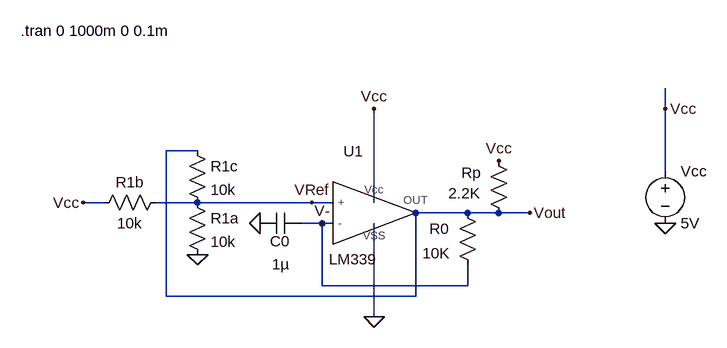
[diagram p0: schematic BAI 5 THUC HANH 2.asc]
BAI 5 THUC HANH 2.asc, the LTspice schematic file:
Version 4.1
SHEET 1 880 680
WIRE 640 -16 640 -48
WIRE -80 48 -128 48
WIRE 640 80 640 -16
WIRE -224 128 -256 128
WIRE -80 128 -144 128
WIRE 96 128 -80 128
WIRE 128 128 96 128
WIRE 192 128 192 -16
WIRE 336 144 256 144
WIRE 384 144 336 144
WIRE 432 144 384 144
WIRE 112 160 80 160
WIRE 128 160 112 160
WIRE 112 256 112 160
WIRE 336 256 336 224
WIRE 336 256 112 256
WIRE -128 272 -128 48
WIRE 256 272 256 144
WIRE 256 272 -128 272
WIRE 192 304 192 160
FLAG 640 160 0
FLAG 192 304 0
FLAG -80 208 0
FLAG 16 160 0
FLAG 432 144 Vout
FLAG 112 160 V-
FLAG 96 128 VRef
FLAG 640 -16 Vcc
FLAG 192 -16 Vcc
FLAG 384 64 Vcc
FLAG -256 128 Vcc
SYMBOL LM339 160 144 R0
SYMATTR InstName U1
SYMBOL voltage 640 64 R0
SYMATTR InstName Vcc
SYMATTR Value 5V
SYMBOL res -128 112 R90
WINDOW 0 0 56 VBottom 2
WINDOW 3 32 56 VTop 2
SYMATTR InstName R1b
SYMATTR Value 10k
SYMBOL res -96 112 R0
SYMATTR InstName R1a
SYMATTR Value 10k
SYMBOL res -96 32 R0
SYMATTR InstName R1c
SYMATTR Value 10k
SYMBOL cap 80 144 R90
WINDOW 0 59 33 VBottom 2
WINDOW 3 63 32 VTop 2
SYMATTR InstName C0
SYMATTR Value 1µ
SYMBOL res 320 128 R0
WINDOW 0 -43 40 Left 2
WINDOW 3 -54 78 Left 2
SYMATTR InstName R0
SYMATTR Value 10K
SYMBOL res 368 48 R0
WINDOW 0 -42 34 Left 2
WINDOW 3 -62 66 Left 2
SYMATTR InstName Rp
SYMATTR Value 2.2K
TEXT -352 -136 Left 2 !.tran 0 1000m 0 0.1m

The netlist it stands for:
* BAI 5 THUC HANH 2.asc
X§U1 VRef V- Vcc 0 Vout LM339  ; pins + - Vcc VSS OUT
Vcc Vcc 0 5V
R1b VRef Vcc 10k
R1a VRef 0 10k
R1c Vout VRef 10k
C0 V- 0 1µ
R0 Vout V- 10K
Rp Vcc Vout 2.2K
.tran 0 1000m 0 0.1m
.lib E:\ThiThucHanhCoHa\CoHa\LM339.cir
.backanno
.end